# EAGLE design T15_PRI_SYS_V1.5 (EAGLE 7.1.0)
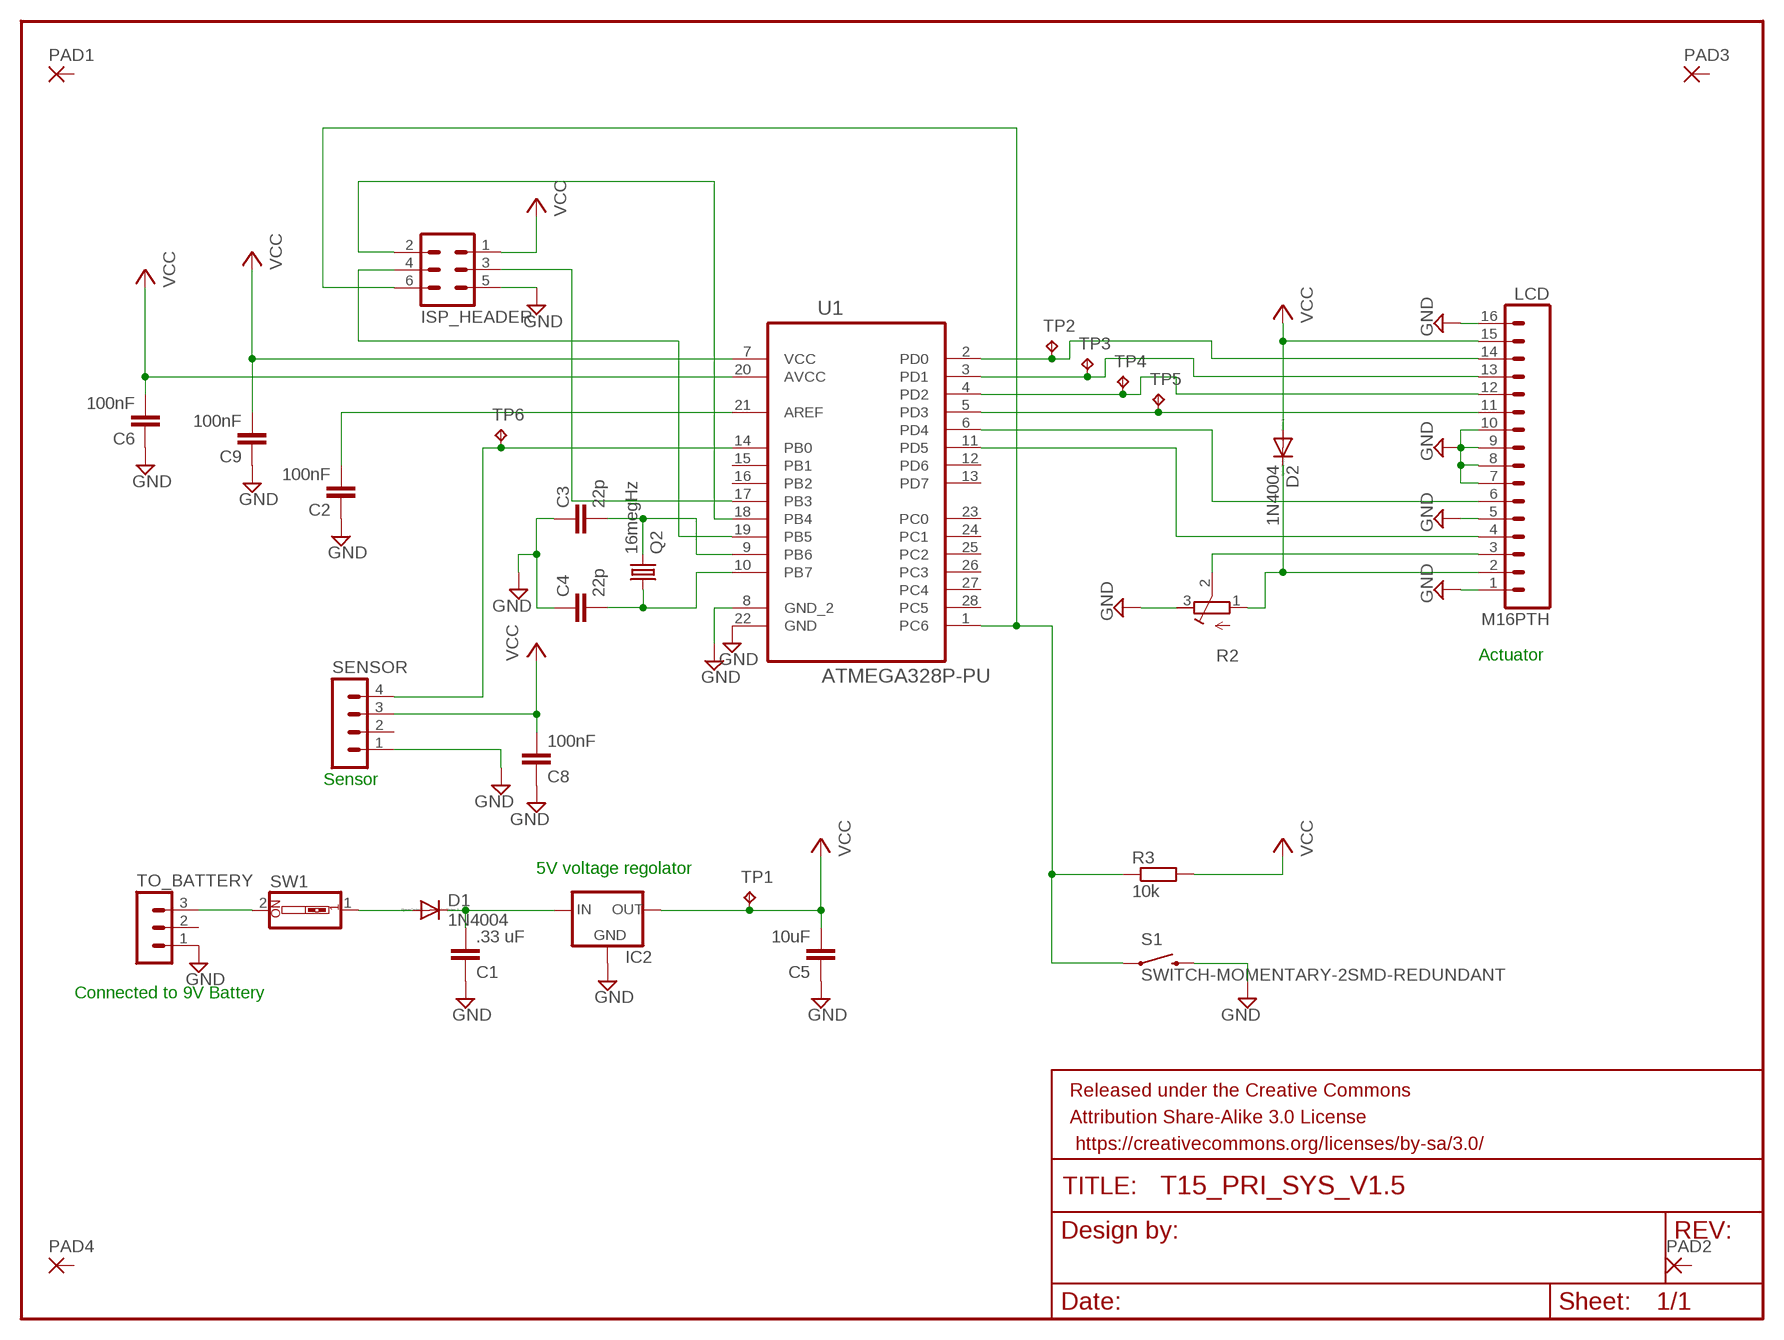
[diagram p0: schematic, sheet 1]

## Parts
C1  .33 uF  C-EU025-024X044  [C025-024X044]
C2  100nF  C-EU025-024X044  [C025-024X044]
C3  22p  C-EU025-024X044  [C025-024X044]
C4  22p  C-EU025-024X044  [C025-024X044]
C5  10uF  C-EU025-024X044  [C025-024X044]
C6  100nF  C-EU025-024X044  [C025-024X044]
C8  100nF  C-EU025-024X044  [C025-024X044]
C9  100nF  C-EU025-024X044  [C025-024X044]
D1  1N4004  [DO41-10]
D2  1N4004  [DO41-10]
FRAME1  FRAME-LETTER  [CREATIVE_COMMONS]
IC2  78XXL  [78XXL]
ISP_HEADER  MA03-2  [MA03-2]
LCD  M16PTH  [1X16]
PAD1  1,6/0,8  [1,6/0,8]
PAD2  1,6/0,8  [1,6/0,8]
PAD3  1,6/0,8  [1,6/0,8]
PAD4  1,6/0,8  [1,6/0,8]
Q2  16megHz  CRYSTALHC49S  [HC49/S]
R2  R-TRIMMTS63Z  [RTRIMTS63Z]
R3  10k  R-EU_0204/5  [0204/5]
S1  SWITCH-MOMENTARY-2SMD-REDUNDANT  [TACTILE-SWITCH-SMD]
SENSOR  MA04-1  [MA04-1]
SW1  SW_DIP-1  [EDG-01]
TO_BATTERY  MA03-1  [MA03-1]
TP1  TPB1,27  [B1,27]
TP2  TPB1,27  [B1,27]
TP3  TPB1,27  [B1,27]
TP4  TPB1,27  [B1,27]
TP5  TPB1,27  [B1,27]
TP6  TPB1,27  [B1,27]
U1  ATMEGA328P-PU  [DIP254P762X457-28]

## Nets
GND: C1.1 C2.1 C3.1 C4.1 C5.1 C6.1 C8.1 C9.1 IC2.GND ISP_HEADER.5 LCD.1 LCD.5 LCD.7 LCD.8 LCD.9 LCD.10 LCD.16 R2.3(E) S1.3 S1.4 SENSOR.1 TO_BATTERY.1 U1.8(GND_2) U1.22(GND)
MISO: ISP_HEADER.2 U1.18(PB4)
MOSI: ISP_HEADER.3 U1.17(PB3)
N$2: D2.C LCD.2 R2.1(A)
N$3: LCD.3 R2.2(S)
N$5: C1.2 D1.C IC2.IN
N$8: C3.2 Q2.2 U1.9(PB6)
N$9: LCD.11 TP5.TP U1.5(PD3)
N$10: C4.2 Q2.1 U1.10(PB7)
N$11: LCD.12 TP4.TP U1.4(PD2)
N$12: LCD.13 TP3.TP U1.3(PD1)
N$13: LCD.14 TP2.TP U1.2(PD0)
N$14: SW1.2 TO_BATTERY.3
N$17: LCD.6 U1.6(PD4)
N$18: LCD.4 U1.11(PD5)
N$20: D1.A SW1.1
PBO: SENSOR.4 TP6.TP U1.14(PB0)
RESET: ISP_HEADER.6 R3.1 S1.1 S1.2 U1.1(PC6)
SCK: ISP_HEADER.4 U1.19(PB5)
VCC: C5.2 C6.2 C8.2 C9.2 D2.A IC2.OUT ISP_HEADER.1 LCD.15 R3.2 SENSOR.3 TP1.TP U1.7(VCC) U1.20(AVCC)
VCC1: C2.2 U1.21(AREF)
Unconnected: PAD1.1(P) PAD2.1(P) PAD3.1(P) PAD4.1(P) SENSOR.2 TO_BATTERY.2 U1.12(PD6) U1.13(PD7) U1.15(PB1) U1.16(PB2) U1.23(PC0) U1.24(PC1) U1.25(PC2) U1.26(PC3) U1.27(PC4) U1.28(PC5)

## Notes on the sheet
- Actuator
- Sensor
- 5V voltage regolator
- Connected to 9V Battery

## Library data of the parts
C1-C6 C8 C9 = rcl:C-EU: CAPACITOR, European symbol
D1 D2 = diode:1N4004: DIODE general purpose rectifier, 1 A
FRAME1 = SparkFun-Retired:FRAME-LETTER: Schematic Frame Standard 8.5x11 US Letter frame
IC2 = v-reg:78XXL: VOLTAGE REGULATOR
ISP_HEADER = con-lstb:MA03-2: PIN HEADER; OC_FARNELL: unknown; OC_NEWARK: unknown
LCD = SparkFun-Connectors:M16: 1x16 .1" header
PAD1-PAD4 = wirepad:1,6/0,8: THROUGH-HOLE PAD
Q2 = crystal:CRYSTAL: CRYSTAL; OC_FARNELL: 1667008; OC_NEWARK: unknown
R2 = rcl:R-TRIMM: Trimm resistor
R3 = rcl:R-EU_: RESISTOR, European symbol
S1 = SparkFun-Electromechanical:SWITCH-MOMENTARY-2: Various NO switches- pushbuttons, reed, etc
SENSOR = con-lstb:MA04-1: PIN HEADER; OC_FARNELL: unknown; OC_NEWARK: unknown
SW1 = special:SW_DIP-1: DIP SWITCH
TO_BATTERY = con-lstb:MA03-1: PIN HEADER; OC_FARNELL: unknown; OC_NEWARK: unknown
TP1-TP6 = testpad:TP: Test pad
U1 = Atmel_By_element14_Batch_1-00:ATMEGA328P-PU: 8-bit Microcontroller with In-System Programmable Flash; MPN: ATMEGA328P-PU; OC_FARNELL: 1715487; OC_NEWARK: 15R0268; PACKAGE: PDIP-28; SUPPLIER: Atmel

## Board
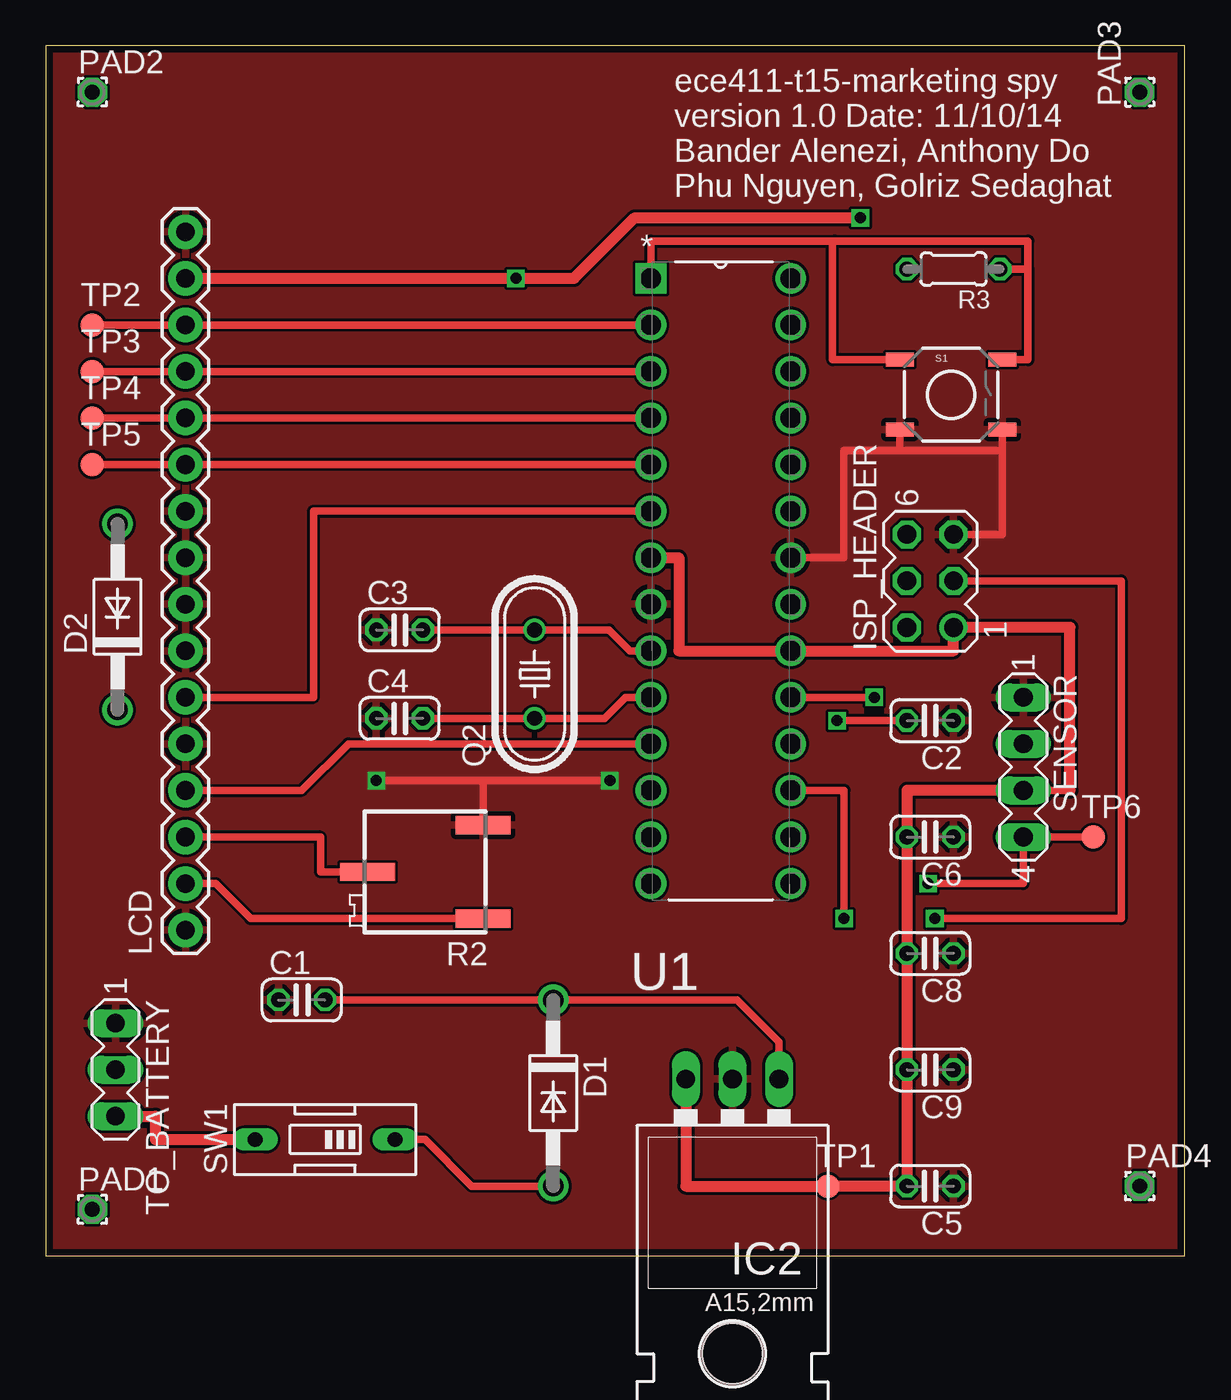
[diagram p1: board, top side]
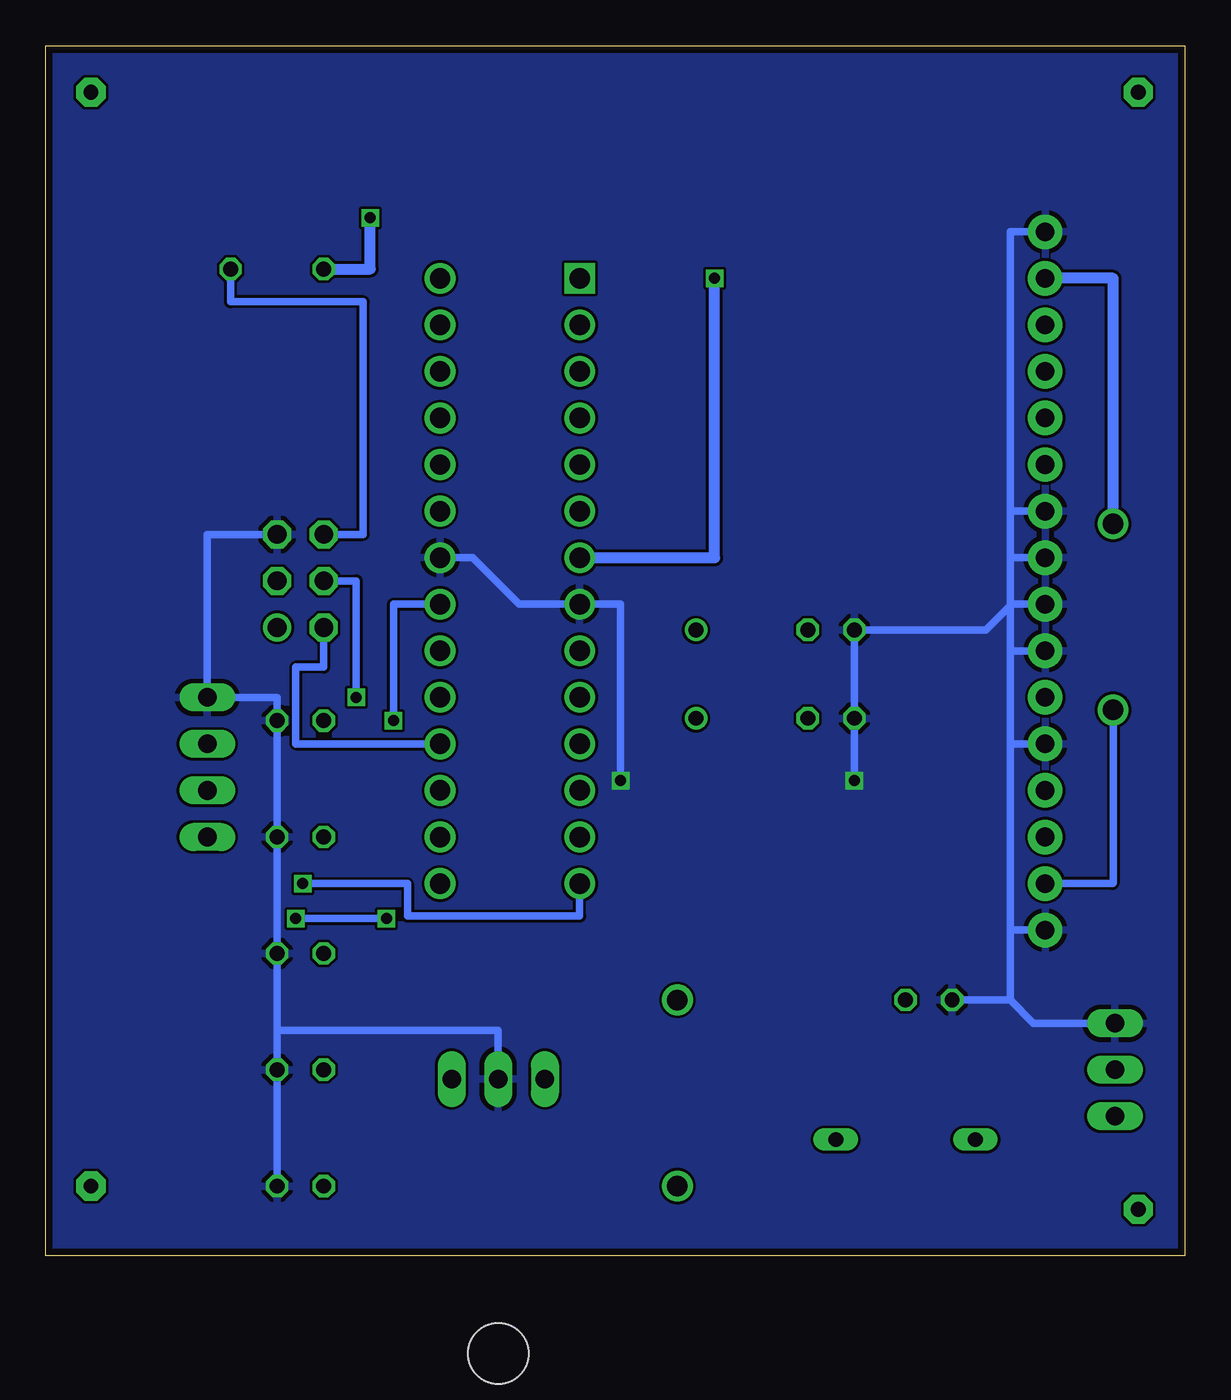
[diagram p2: board, bottom side, seen from below]

Size 62.15 x 66.03 mm. Coordinates in mm from the lower left corner, seen from the top.
Outline: 0,0 62.15,0 62.15,66.03 0,66.03 0,0
Copper layers (1*16): Top 0.0356mm / dielectric 1.5011mm / Bottom 0.0356mm
Design rules "DRC": minimum track width 6mil, minimum drill 13mil, track to track 6mil, track to pad 6mil, pad to pad 6mil, via to via 6mil, smd to smd 6mil, copper to edge 15mil, drill to drill 6mil, minimum pad ring 7mil, minimum via ring 7mil, stop-mask expansion 3mil, vias tented up to drill 0mil, thermal gap 10mil

### Footprints (pad centres in the part's own frame; a part is rotated, then mirrored left to right if it is on the bottom)
C025-024X044 = drill 0.813 octagon: 1 -1.27,0; 2 1.27,0
DO41-10 = drill 1.118: A 5.08,0; C -5.08,0
78XXL = drill 1.016 long: GND 0,-3.81; IN -2.54,-3.81; OUT 2.54,-3.81 | hole 3.302: 0,11.176
MA03-2 = drill 1.016: 1 -2.54,-1.27 | drill 1.016 octagon: 2 -2.54,1.27; 3 0,-1.27; 4 0,1.27; 5 2.54,-1.27; 6 2.54,1.27
1X16 = drill 1.016 pad 1.88: 1 0,0; 2 2.54,0; 3 5.08,0; 4 7.62,0; 5 10.16,0; 6 12.7,0; 7 15.24,0; 8 17.78,0; 9 20.32,0; 10 22.86,0; 11 25.4,0; 12 27.94,0; 13 30.48,0; 14 33.02,0; 15 35.56,0; 16 38.1,0
1,6/0,8 = drill 0.813 pad 1.6 octagon: 1 0,0
HC49/S = drill 0.813: 1 -2.413,0; 2 2.413,0
RTRIMTS63Z = smd 1 x 3: 1 -2.55,-3.15; 2 0,3.15; 3 2.55,-3.15
0204/5 = drill 0.813 octagon: 1 -2.54,0; 2 2.54,0
TACTILE-SWITCH-SMD = smd 1.524 x 0.762: 1 -2.794,1.905; 2 2.794,1.905; 3 -2.794,-1.905; 4 2.794,-1.905
MA04-1 = drill 1.016 long: 1 -3.81,0; 2 -1.27,0; 3 1.27,0; 4 3.81,0
EDG-01 = drill 0.813 long: 1 0,-3.81; 2 0,3.81
MA03-1 = drill 1.016 long: 1 -2.54,0; 2 0,0; 3 2.54,0
B1,27 = smd 1.27 x 1.27: TP 0,0
DIP254P762X457-28 = drill 1.118 square: 1 -7.62,33.02 | drill 1.118: 2 -7.62,30.48; 3 -7.62,27.94; 4 -7.62,25.4; 5 -7.62,22.86; 6 -7.62,20.32; 7 -7.62,17.78; 8 -7.62,15.24; 9 -7.62,12.7; 10 -7.62,10.16; 11 -7.62,7.62; 12 -7.62,5.08; 13 -7.62,2.54; 14 -7.62,0; 15 0,0; 16 0,2.54; 17 0,5.08; 18 0,7.62; 19 0,10.16; 20 0,12.7; 21 0,15.24; 22 0,17.78; 23 0,20.32; 24 0,22.86; 25 0,25.4; 26 0,27.94; 27 0,30.48; 28 0,33.02

### Placement (x,y rotation side)
C1  13.97,13.97 0 top
C2  48.26,29.21 180 top
C3  19.3,34.16 0 top
C4  19.3,29.34 0 top
C5  48.26,3.81 180 top
C6  48.26,22.86 180 top
C8  48.26,16.51 180 top
C9  48.26,10.16 180 top
D1  27.69,8.89 270 top
D2  3.91,34.87 90 top
FRAME1  -78.74,58.42 0 top  (outside the outline)
IC2  37.47,5.84 180 top
ISP_HEADER  48.26,36.83 90 top
LCD  7.62,17.78 90 top
PAD1  2.54,2.54 0 top
PAD2  2.54,63.5 0 top
PAD3  59.69,63.5 90 top
PAD4  59.69,3.81 0 top
Q2  26.67,31.75 90 top
R2  20.7,20.95 90 top
R3  49.53,53.85 180 top
S1  49.4,46.99 0 top
SENSOR  53.34,26.67 270 top
SW1  15.24,6.35 90 top
TO_BATTERY  3.81,10.16 270 top
TP1  42.67,3.81 0 top
TP2  2.54,50.8 0 top
TP3  2.54,48.26 0 top
TP4  2.54,45.72 0 top
TP5  2.54,43.18 0 top
TP6  57.15,22.86 0 top
U1  40.64,20.32 0 top

### Tracks (layer width: path | path; a pad name or v marks a point on that pad's centre or on a via)
GND  (via drill 0.6)
  Top 0.406: S1.4 52.2,43.94 | 52.2,43.94 46.61,43.94 | 46.61,43.94 S1.3 | ISP_HEADER.5 52.2,39.37 52.2,43.94 | U1.22 43.56,38.1 43.56,43.94 46.61,43.94 | v18.03,25.93 23.85,25.93 | 23.85,25.93 R2.3 | R2.3 | v30.79,25.93 23.85,25.93
  Bottom 0.406: LCD.16 9.53,55.88 9.53,40.64 | LCD.10 9.53,40.64 | 9.53,40.64 9.53,38.1 | LCD.9 9.53,38.1 | 9.53,38.1 9.53,35.56 | LCD.8 9.53,35.56 | 9.53,35.56 9.53,35.48 | 9.53,35.48 9.53,33.02 | LCD.7 9.53,33.02 | 9.53,33.02 9.53,27.94 | LCD.5 9.53,27.94 | 9.53,27.94 9.53,17.78 | LCD.1 9.53,17.78 | 9.53,17.78 9.53,13.97 | 9.53,13.97 C1.1 | TO_BATTERY.1 8.26,12.7 9.53,13.97 | ISP_HEADER.5 53.34,39.37 SENSOR.1 49.53,30.48 C2.1 C6.1 C8.1 49.53,12.32 | 49.53,12.32 C9.1 C5.1 | IC2.GND 37.47,12.32 49.53,12.32 | U1.22 38.86,38.1 36.32,35.56 U1.8 30.79,35.56 v30.79,25.93 | v18.03,25.93 C4.1 C3.1 10.85,34.16 9.53,35.48
  pour Bottom: -1.27,67.31 63.5,67.31 63.5,-1.27 -1.27,-1.27
  pour Top: -1.27,67.31 63.5,67.31 63.5,-1.27 -1.27,-1.27
  pour Bottom: -1.27,67.31 63.5,67.31 63.5,-1.27 -1.27,-1.27 -1.27,66.04
MISO
  Bottom 0.406: U1.18 48.51,27.94 48.51,32.13 46.99,32.13 ISP_HEADER.2
MOSI  (via drill 0.6)
  Top 0.406: ISP_HEADER.3 58.67,36.83 58.67,18.41 v48.51,18.41 | v43.56,18.41 43.56,25.4 U1.17
  Bottom 0.406: v48.51,18.41 v43.56,18.41
N$2
  Top 0.406: LCD.2 9.27,20.32 11.18,18.41 23.84,18.41 R2.1
  Bottom 0.406: D2.C 3.91,20.34 3.94,20.32 LCD.2
N$3
  Top 0.406: R2.2 14.99,20.95 14.99,22.86 LCD.3
N$5
  Top 0.406: C1.2 D1.C 37.72,13.97 40.01,11.68 IC2.IN
N$8
  Top 0.406: U1.9 31.88,33.02 30.73,34.16 Q2.2 C3.2
N$9
  Top 0.406: U1.5 LCD.11 TP5.TP
N$10
  Top 0.406: U1.10 31.62,30.48 30.48,29.34 Q2.1 C4.2
N$11
  Top 0.406: U1.4 LCD.12 TP4.TP
N$12
  Top 0.406: U1.3 LCD.13 TP3.TP
N$13
  Top 0.406: U1.2 LCD.14 TP2.TP
N$14
  Top 0.61: TO_BATTERY.3 5.97,7.62 5.97,6.35 SW1.2
N$17
  Top 0.406: LCD.6 14.61,30.48 14.61,40.64 U1.6
N$18
  Top 0.406: LCD.4 13.97,25.4 16.51,27.94 U1.11
N$20
  Top 0.406: D1.A 23.24,3.81 20.7,6.35 SW1.1
PBO  (via drill 0.6)
  Top 0.406: TP6.TP SENSOR.4 53.34,20.32 v48.13,20.32
  Bottom 0.406: v48.13,20.32 42.42,20.32 42.42,18.54 33.02,18.54 U1.14
RESET
  Top 0.406: R3.1 53.59,53.85 | 53.59,53.85 53.59,55.37 43.05,55.37 | 53.59,53.85 53.59,48.9 S1.2 | U1.1 33.02,55.37 43.05,55.37 | S1.1 42.93,48.9 42.93,55.24 43.05,55.37
  Bottom 0.406: ISP_HEADER.6 44.83,39.37 44.83,52.07 52.07,52.07 R3.1
SCK  (via drill 0.6)
  Top 0.406: v45.21,30.48 U1.19
  Bottom 0.406: ISP_HEADER.4 45.21,36.83 v45.21,30.48
VCC  (via drill 0.6)
  Top 0.406: SENSOR.3 55.88,25.4
  Top 0.61: LCD.15 v25.65,53.34 28.83,53.34 32.13,56.64 v44.45,56.64 | U1.7 34.54,38.1 34.54,33.02 U1.20 49.53,33.02 ISP_HEADER.1 55.88,34.29 55.88,25.4 | SENSOR.3 46.99,25.4 C6.2 C8.2 C9.2 C5.2 TP1.TP 34.92,3.81 IC2.OUT
  Bottom 0.61: R3.2 44.45,53.85 v44.45,56.64 | D2.A 3.91,53.34 LCD.15 | U1.7 25.65,38.1 v25.65,53.34
VCC1  (via drill 0.6)
  Top 0.406: C2.2 v43.18,29.21
  Bottom 0.406: v43.18,29.21 43.18,35.56 U1.21

### Text on the board
tNames: ece411-t15-marketing spy / version 1.0 Date: 11/10/14 / Bander Alenezi, Anthony Do / Phu Nguyen, Golriz Sedaghat